# EAGLE design Hello_Bomi (EAGLE 9.3.0)
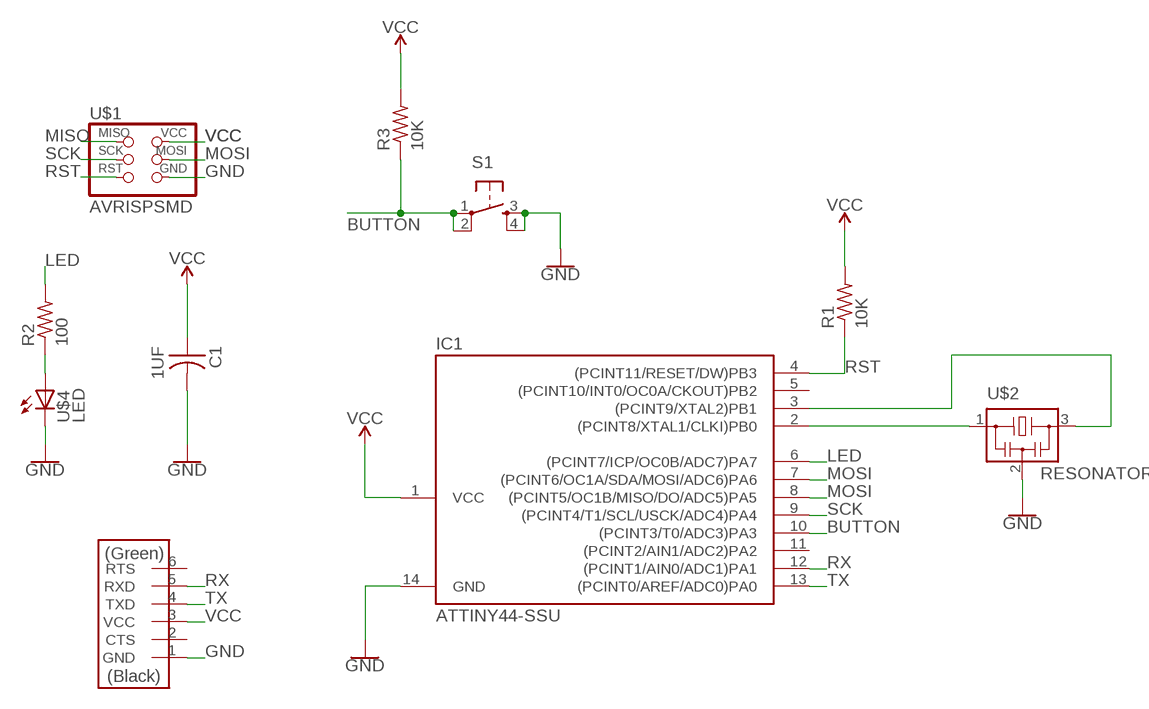
[diagram p0: schematic, sheet 1]

## Parts
C1  1UF  CAP-US1206FAB  [C1206FAB]
IC1  ATTINY44-SSU  [SOIC14]
R1  10K  RES-US1206FAB  [R1206FAB]
R2  100  RES-US1206FAB  [R1206FAB]
R3  10K  RES-US1206FAB  [R1206FAB]
S1  6MM_SWITCH6MM_SWITCH  [6MM_SWITCH]
U$1  AVRISPSMD  [2X03SMD]
U$2  RESONATOR  [EFOBM]
U$3  FTDI-SMD-HEADER  [1X06SMD]
U$4  LED  LEDFAB1206  [LED1206FAB]

## Nets
BUTTON: IC1.10((PCINT3/T0/ADC3)PA3) R3.1 S1.1(P) S1.2(P1)
GND: C1.2 IC1.14(GND) S1.3(S) S1.4(S1) U$1.6(GND) U$2.2 U$3.1(GND) U$4.2(C)
LED: IC1.6((PCINT7/ICP/OC0B/ADC7)PA7) R2.2
MISO: U$1.1(MISO)
MOSI: IC1.7((PCINT6/OC1A/SDA/MOSI/ADC6)PA6) IC1.8((PCINT5/OC1B/MISO/DO/ADC5)PA5) U$1.4(MOSI)
N$1: R2.1 U$4.1(A)
N$2: IC1.2((PCINT8/XTAL1/CLKI)PB0) U$2.1
N$3: IC1.3((PCINT9/XTAL2)PB1) U$2.3
RST: IC1.4((PCINT11/RESET/DW)PB3) R1.1 U$1.5(RST)
RX: IC1.12((PCINT1/AIN0/ADC1)PA1) U$3.5(RXD)
SCK: IC1.9((PCINT4/T1/SCL/USCK/ADC4)PA4) U$1.3(SCK)
TX: IC1.13((PCINT0/AREF/ADC0)PA0) U$3.4(TXD)
VCC: C1.1 IC1.1(VCC) R1.2 R3.2 U$1.2(VCC) U$3.3(VCC)
Unconnected: IC1.5((PCINT10/INT0/OC0A/CKOUT)PB2) IC1.11((PCINT2/AIN1/ADC2)PA2) U$3.2(CTS) U$3.6(RTS)

## Library data of the parts
C1 = fab:CAP-US
IC1 = fab:ATTINY44
R1-R3 = fab:RES-US: Resistor (US Symbol) Variants with postfix FAB are widened to allow the routing of internal traces
S1 = fab:6MM_SWITCH: OMRON SWITCH
U$1 = fab:AVRISP
U$2 = fab:RESONATOR
U$3 = fab:FTDI-SMD-HEADER
U$4 = fab:LED: LED

## Board
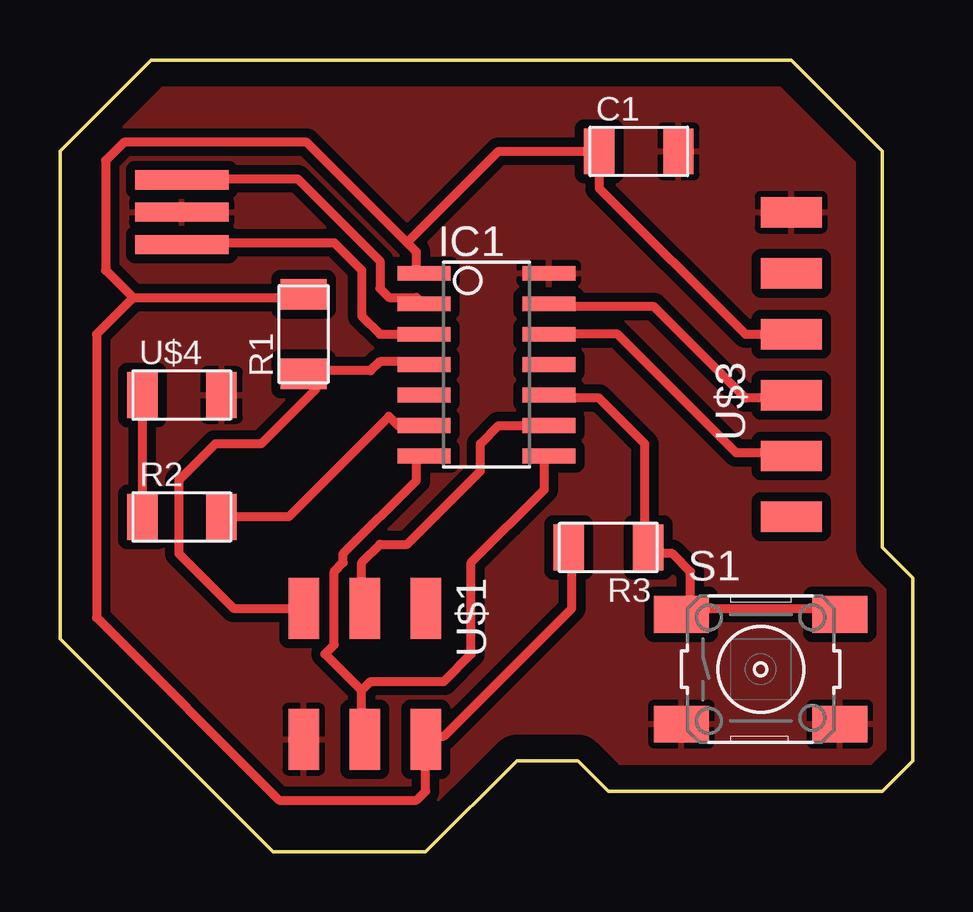
[diagram p1: board, top side]

Size 35.56 x 33.02 mm. Coordinates in mm from the lower left corner, seen from the top.
Outline: 0,29.21 0,8.89 8.89,0 15.24,0 19.05,3.81 21.59,3.81 22.86,2.54 34.29,2.54 35.56,3.81 35.56,11.43 34.29,12.7 34.29,29.21 30.48,33.02 3.81,33.02 0,29.21
Copper layers (1*16): Top 0.035mm / dielectric 1.5mm / Bottom 0.035mm
Design rules "default *": minimum track width 15mil, minimum drill 0.35mm, track to track 15mil, track to pad 15mil, pad to pad 15mil, via to via 15mil, smd to smd 15mil, copper to edge 40mil, drill to drill 6mil, minimum pad ring 10mil, minimum via ring 8mil, stop-mask expansion 4mil, vias tented up to drill 0mil, thermal gap 10mil

### Footprints (pad centres in the part's own frame; a part is rotated, then mirrored left to right if it is on the bottom)
C1206FAB = smd 1.27 x 1.905: 1 -1.651,0; 2 1.651,0
SOIC14 = smd 0.61 x 2.21: 1 -3.81,-2.603; 2 -2.54,-2.603; 3 -1.27,-2.603; 4 0,-2.603; 5 1.27,-2.603; 6 2.54,-2.603; 7 3.81,-2.603; 8 3.81,2.603; 9 2.54,2.603; 10 1.27,2.603; 11 0,2.603; 12 -1.27,2.603; 13 -2.54,2.603; 14 -3.81,2.603
R1206FAB = smd 1.27 x 1.905: 1 -1.651,0; 2 1.651,0
6MM_SWITCH = smd 2.286 x 1.524: 1 -3.302,2.286; 2 3.302,2.286; 3 -3.302,-2.286; 4 3.302,-2.286
2X03SMD = smd 2.54 x 1.27: 1 -2.54,2.54; 2 2.92,2.54; 3 -2.54,0; 4 2.92,0; 5 -2.54,-2.54; 6 2.92,-2.54
EFOBM = smd 0.8 x 3.9: 1 -1.35,0; 2 0,0; 3 1.35,0
1X06SMD = smd 2.54 x 1.27: 1 0,6.35; 2 0,3.81; 3 0,1.27; 4 0,-1.27; 5 0,-3.81; 6 0,-6.35
LED1206FAB = smd 1.27 x 1.905: 1 -1.651,0; 2 1.651,0

### Placement (x,y rotation side)
C1  24.13,29.21 0 top
IC1  17.78,20.32 270 top
R1  10.16,21.59 90 top
R2  5.08,13.97 0 top
R3  22.86,12.7 180 top
S1  29.21,7.62 0 top
U$1  12.7,7.62 270 top
U$2  5.08,26.67 270 top
U$3  30.48,20.32 0 top
U$4  5.08,19.05 0 top

### Tracks (layer width: path | path; a pad name or v marks a point on that pad's centre or on a via)
BUTTON
  Top 0.381: 26.29,10.16 26.29,11.68 25.53,12.45 24.77,12.45 R3.1 24.38,12.83 24.38,17.02 22.48,18.92 20.57,18.92 IC1.10 | 26.29,10.16 25.91,9.78 S1.1 26.29,10.16 | 26.29,10.16 32.38,10.16 S1.2
GND
  pour Top: 0,1.27 0,29.21 5.08,34.29 31.75,34.29 35.56,30.48 35.56,2.54 34.29,1.27
LED
  Top 0.381: R2.2 9.53,13.97 13.72,18.16 14.1,17.78 IC1.6
MOSI
  Top 0.381: 12.57,6.73 11.05,8.26 11.43,8.64 11.43,11.68 11.81,12.07 11.81,12.45 14.86,15.49 14.86,16.26 IC1.7 | 12.57,6.73 12.57,4.83 U$1.4 | 12.57,6.73 12.95,7.11 16,7.11 17.14,8.26 17.14,12.07 20.19,15.11 20.19,16.26 IC1.8
N$1
  Top 0.381: U$4.1 R2.1
N$2
  Top 0.381: IC1.2 14.86,23.11 13.72,23.11 13.33,23.5 13.33,24.64 9.91,28.07 5.33,28.07 U$2.1
N$3
  Top 0.381: IC1.3 13.33,21.59 12.57,22.35 12.57,24.26 11.43,25.4 5.33,25.4 U$2.3
RST
  Top 0.381: 10.67,20.07 12.95,20.07 13.33,20.45 14.86,20.45 IC1.4 | 10.67,20.07 10.29,20.07 R1.1 10.67,20.07 | U$1.5 7.24,10.16 4.95,12.45 4.95,15.49 6.48,17.02 8.38,17.02 10.67,19.3 10.67,20.07
RX
  Top 0.381: IC1.12 23.24,21.59 28.19,16.64 30.48,16.64 U$3.5
SCK
  Top 0.381: IC1.9 18.29,17.78 17.53,17.02 17.53,15.88 14.48,12.83 13.33,12.83 12.57,12.07 12.57,10.16 U$1.3
TX
  Top 0.381: IC1.13 20.57,22.73 24.77,22.73 28.57,18.92 30.48,18.92 U$3.4
VCC
  Top 0.381: R3.2 21.34,12.45 21.34,10.16 16,4.83 15.24,4.83 U$1.2 15.24,2.54 14.86,2.16 9.14,2.16 1.52,9.78 1.52,21.59 3.05,23.11 | 3.05,23.11 9.91,23.11 R1.2 | 3.05,23.11 1.9,24.26 1.9,28.83 2.67,29.59 10.29,29.59 14.48,25.4 | 14.48,25.4 14.86,25.02 14.86,24.26 IC1.1 | 14.48,25.4 18.29,29.21 C1.1 22.48,27.69 28.57,21.59 U$3.3